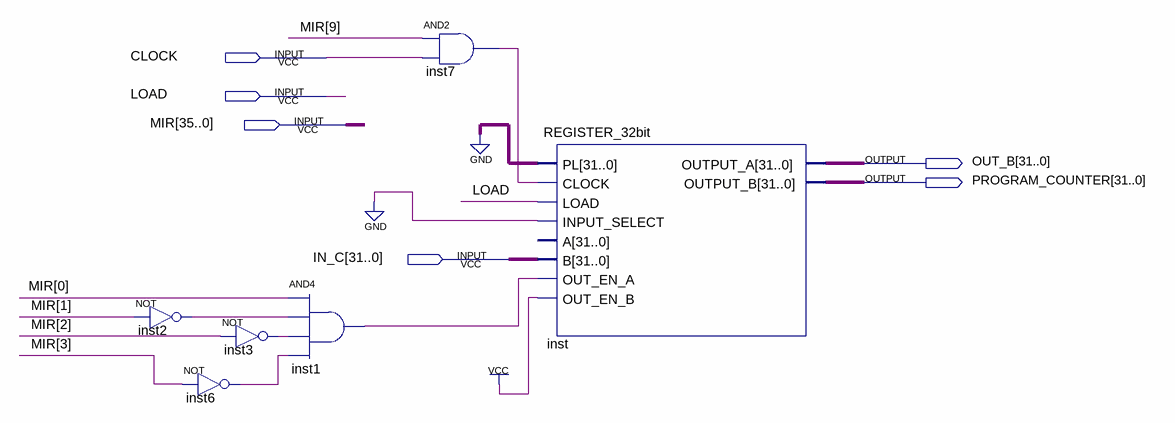
[diagram p0: schematic sheet]
// Quartus schematic PC.bdf as structural Verilog: 6 symbols, 6 pins
module PC (
  input  CLOCK,
  input  LOAD,
  input  [35:0] MIR,
  input  [31:0] IN_C,
  output [31:0] OUT_B,
  output [31:0] PROGRAM_COUNTER
);

  wire inst1_out, inst2_out, inst3_out, inst6_out, inst7_out;

  not inst2 (inst2_out, MIR[1]);
  not inst6 (inst6_out, MIR[3]);
  and inst1 (inst1_out, MIR[0], inst2_out, inst3_out, inst6_out);
  not inst3 (inst3_out, MIR[2]);
  and inst7 (inst7_out, MIR[9], CLOCK);
  REGISTER_32bit inst (
    .PL({32{1'b0}}), .CLOCK(inst7_out), .LOAD(LOAD), .INPUT_SELECT(1'b0), .B(IN_C), .OUT_EN_A(inst1_out),
    .OUT_EN_B(1'b1), .OUTPUT_A(OUT_B), .OUTPUT_B(PROGRAM_COUNTER));  // open: A
endmodule
